# EAGLE design og22 (EAGLE 7.7.0)
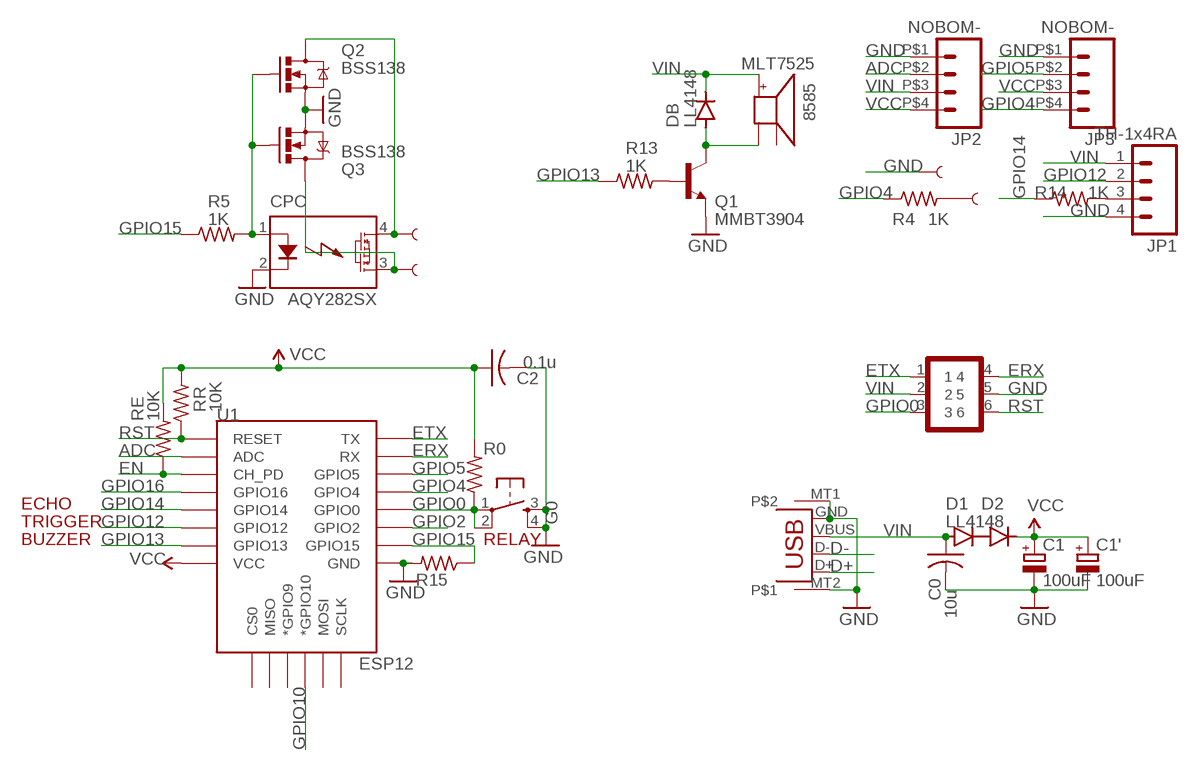
[diagram p0: schematic, sheet 1]

## Parts
8585  MLT7525  BUZZER  [SMT-8585-BUZZER]
C0  10u  C-USC0805K  [C0805K]
C1  100uF  CPOL-EUC  [PANASONIC_C]
C1'  100uF  CPOL-EUC  [PANASONIC_C]
C2  0.1u  C-USC0603K  [C0603K]
CPC  AQY282SX  AQY282  [PHOTOMOS]
D1  LL4148  DIODE-MINIMELF  [MINIMELF]
D2  LL4148  DIODE-MINIMELF  [MINIMELF]
DB  LL4148  DIODE-MINIMELF  [MINIMELF]
G0  TH-6x11  SPST_TACTEVQQ2  [EVQ-Q2]
JP1  TH-1x4RA  M04EXT2  [1X04_SONICSENSOR_EXT2]
JP2  NOBOM-  M042X2  [1X04-2X2]
JP3  NOBOM-  M042X2  [1X04-2X2]
Q1  MMBT3904  TRANSISTOR_NPNSOT23-3  [SOT23-3]
Q2  BSS138  MOSFET-NCHANNELSMD  [SOT23-3]
Q3  BSS138  MOSFET-NCHANNELSMD  [SOT23-3]
R0  10K  R-US_R0603  [R0603]
R4  1K  R-US_R0603  [R0603]
R5  1K  R-US_R0603  [R0603]
R13  1K  R-US_R0603  [R0603]
R14  1K  R-US_R0603  [R0603]
R15  10K  R-US_R0603  [R0603]
RE  10K  R-US_R0603  [R0603]
RR  10K  R-US_R0603  [R0603]
U1  ESP12  ESP12ESMD  [ESP12E-SMD]
U$1  NOBOM-GF2x3  GOLDFINGER_2X3  [GOLDFINGER_2X3]
U$2  NOBOM-  SEWTAP7MMD  [PETAL-7MM-DOUBLE]
U$3  NOBOM-  SEWTAP7MMD  [PETAL-7MM-DOUBLE]
U$4  NOBOM-  SEWTAP7MMD  [PETAL-7MM-DOUBLE]
U$5  NOBOM-  SEWTAP7MMD  [PETAL-7MM-DOUBLE]
X3  MICROXNJ  USB+GND  [USB-MICROB2]

## Nets
ADC: JP2.P$2 U1.ADC
D+: X3.D+
D-: X3.D-
EN [power]: RE.1 U1.CH_PD
ERX: U1.RXD0(RX) U$1.4
ETX: U1.TXD0(TX) U$1.1
GND: C0.2 C1'.- C1.- C2.2 CPC.2(K) G0.3 G0.4 JP1.4 JP2.P$1 JP3.P$1 Q1.2(E) Q2.2(S) Q3.2(S) R15.2 U1.GND U$1.5 U$4.P$1 X3.GND X3.MT1 X3.MT2
GPIO0: G0.1 G0.2 R0.1 U1.GPIO0 U$1.3
GPIO2: U1.GPIO2
GPIO4: JP3.P$4 R4.1 U1.GPIO4
GPIO5: JP3.P$2 U1.GPIO5
GPIO10: U1.GPIO10(*GPIO10)
GPIO12: JP1.2 U1.GPIO12
GPIO13: R13.1 U1.GPIO13
GPIO14: R14.1 U1.GPIO14
GPIO15: R5.1 R15.1 U1.GPIO15
GPIO16: U1.GPIO16
N$1: CPC.4(DS1) Q2.3(D) U$3.P$1
N$2: CPC.3(DS2) Q3.3(D) U$2.P$1
N$3: R4.2 U$5.P$1
N$5: JP1.3 R14.2
N$6 [power]: 8585.- DB.A Q1.3(C)
N$8: Q1.1(B) R13.2
N$9: CPC.1(A) Q2.1(G) Q3.1(G) R5.2
N$11: D1.C D2.A
RST: RR.1 U1.RESET U$1.6
VCC [power]: C1'.+ C1.+ C2.1 D2.C JP2.P$4 JP3.P$3 R0.2 RE.2 RR.2 U1.VCC
VIN [power]: 8585.+ C0.1 D1.A DB.C JP1.1 JP2.P$3 U$1.2 X3.VBUS
Unconnected: 8585.A- U1.CS0 U1.GPIO9(*GPIO9) U1.MISO U1.MOSI U1.SCLK

## Notes on the sheet
- ECHO
- TRIGGER
- BUZZER | RELAY

## Library data of the parts
8585 = adafruit:BUZZER
C0 C2 = adafruit:C-US: CAPACITOR, American symbol
C1 C1' = rcl:CPOL-EU: POLARIZED CAPACITOR, European symbol; SPICEPREFIX: C
CPC = adafruit:AQY282
D1 D2 DB = diode:DIODE-: DIODE
G0 = adafruit_3:SPST_TACT: SMT 6mm switch, EVQQ2 series http://www.ladyada.net/library/eagle
JP1-JP3 = SparkFun:M04: Header 4 Standard 4-pin 0.1" header. Use with straight break away headers (SKU : PRT-00116), right angle break away headers (PRT-00553), swiss pins (PRT-00743), machine pins (PRT-00117), and female headers (PRT-00115). Molex polarized connector foot print use with SKU : PRT-08231 with associated crimp pins and housings.
Q1 = SparkFunNew:TRANSISTOR_NPN: Transistor NPN BJT configuration in SOT23 package. MMBT2222 is the common NPN we use. Double check BCE configuration again layout.
Q2 Q3 = SparkFunNew:MOSFET-NCHANNEL
R0 R15 RE RR = adafruit (picker 的冲突副本 2014-10-29):R-US_: RESISTOR, American symbol
R4 R5 R13 R14 = adafruit2013:R-US_: RESISTOR, American symbol
U1 = esp8266modules:ESP12E: ESP12E Module
U$1 = SparkFunNew:GOLDFINGER_2X3
U$2-U$5 = LilyPad-Wearables:SEWTAP
X3 = SparkFunNew:USB+GND

## Net classes
0 default: width 0.254 mm, clearance 0.203 mm
1 power: width 0.305 mm, clearance 0.203 mm
2 relaypower: width 0.406 mm, clearance 0.305 mm

## Board
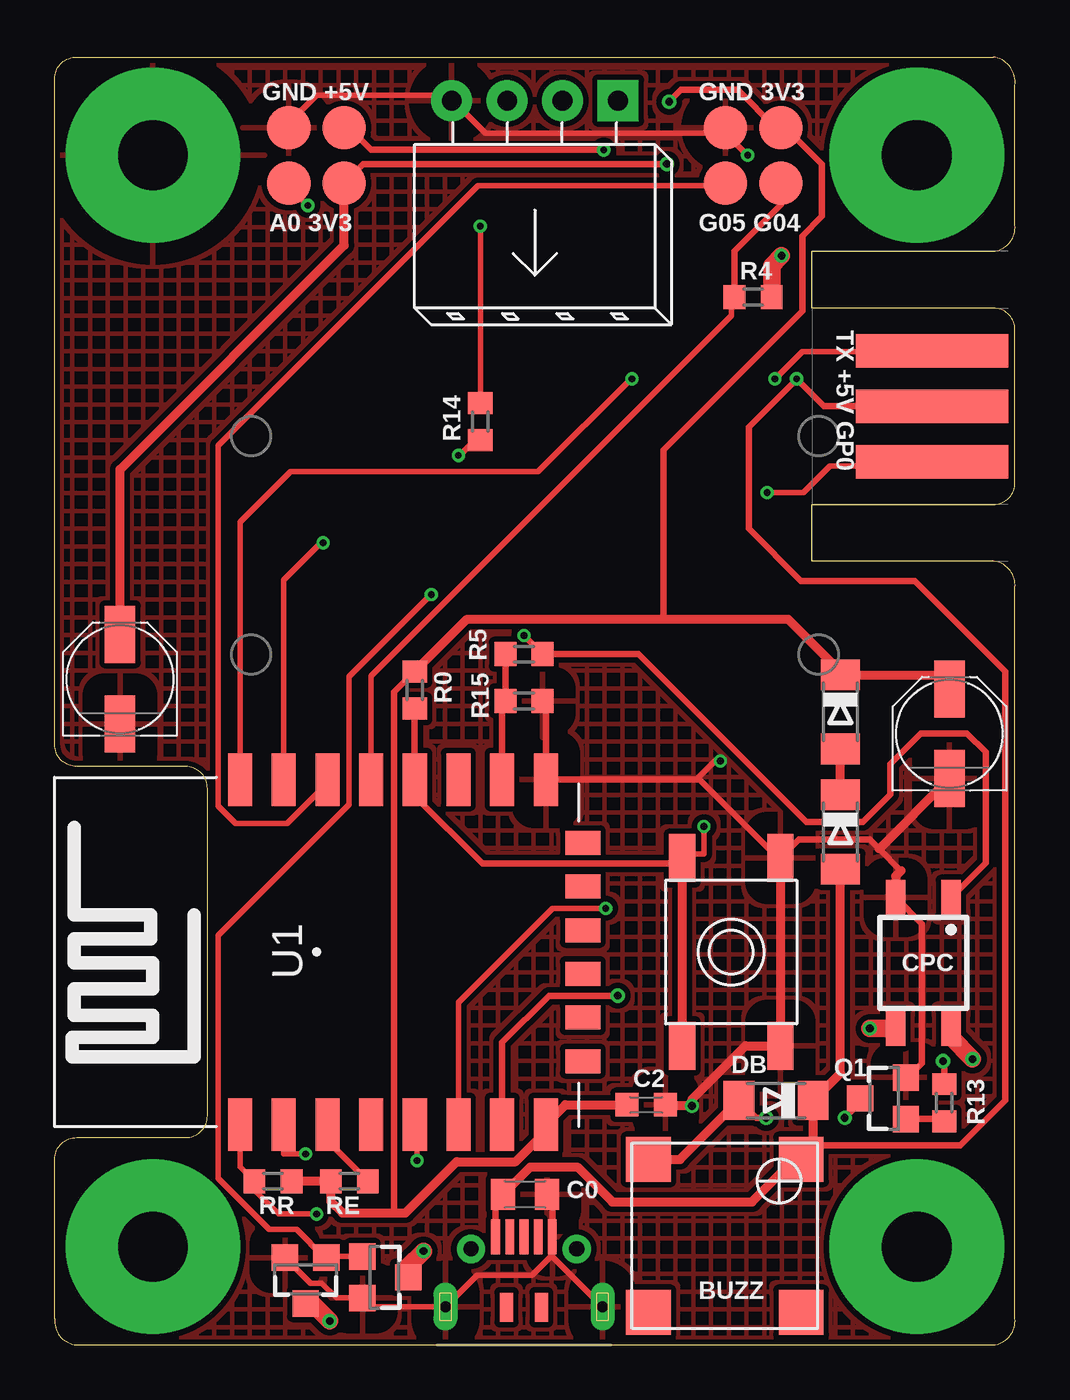
[diagram p1: board, top side]
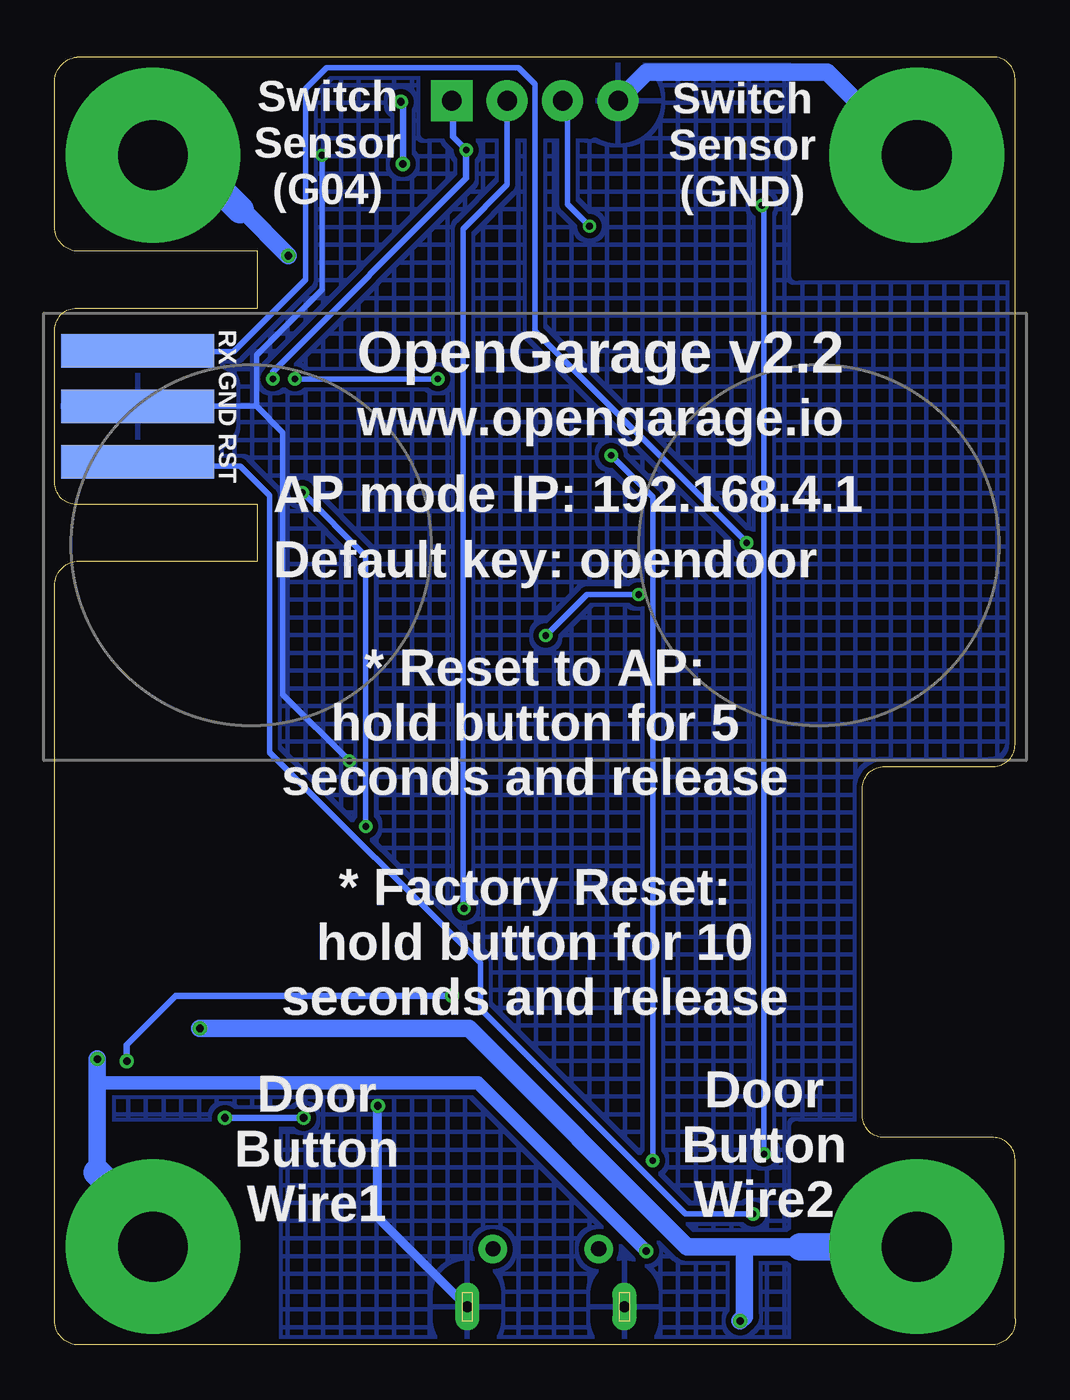
[diagram p2: board, bottom side, seen from below]

Size 44.01 x 59 mm. Coordinates in mm from the lower left corner, seen from the top.
Outline: 1,0 43,0 arc90 44,1.2 44,34.7 arc90 43,35.9 34.7,35.9 34.7,38.5 43,38.5 arc90 44,39.5 44,46.5 arc90 43,47.5 34.7,47.5 34.7,50.1 43,50.1 arc90 44,51.3 44,57.7 arc90 43,59 1,59 arc90 0,58 0,27.5 arc90 1,26.5 6,26.5 arc-90 7,25.5 7,10.5 arc-90 6,9.5 1,9.5 arc90 0,8.5 0,1.2 arc90 1,0
Copper layers (1*16): Top 0.035mm / dielectric 1.5mm / Bottom 0.035mm
Design rules "Fusion_eagle_rule_v1.1 *": minimum track width 6mil, minimum drill 12mil, track to track 6mil, track to pad 6mil, pad to pad 6mil, via to via 6mil, smd to smd 0mil, copper to edge 10mil, drill to drill 10mil, minimum pad ring 10mil, minimum via ring 6mil, stop-mask expansion 2mil, vias tented up to drill 100mil, thermal gap 40mil
bRestrict: area 0,49 to 10,59; area 34,49 to 44,59; area 34,0 to 44,10; area 0,0 to 10,10; area 19.5,55.5 to 27,58.5
vRestrict: area 7,11 to 24,25

### Footprints (pad centres in the part's own frame; a part is rotated, then mirrored left to right if it is on the bottom)
SMT-8585-BUZZER = smd 2.05 x 2.05: + -3.5,3.5; - -3.5,-3.5; A- 3.5,-3.5; NC1 3.5,3.5
C0805K = smd 1.1 x 1.4: 1 -1,0; 2 1,0
PANASONIC_C = smd 2.6 x 1.4: + 2.05,0; - -2.05,0
C0603K = smd 1.05 x 1.08: 1 -0.875,0; 2 0.875,0
PHOTOMOS = smd 0.9 x 1.6: 1 1.27,3; 2 -1.27,3; 3 -1.27,-3; 4 1.27,-3
MINIMELF = smd 1.4 x 1.8: A 1.7,0; C -1.7,0
EVQ-Q2 = smd 2.2 x 1.2: 1 -4.3,-2.25; 2 4.3,-2.25; 3 -4.3,2.25; 4 4.3,2.25
1X04_SONICSENSOR_EXT2 = drill 0.9 pad 1.88 square: 1 -3.81,0 | drill 0.9 pad 1.88: 2 -1.27,0; 3 1.27,0; 4 3.81,0
1X04-2X2 = smd 2 x 2: P$1 -1.27,1.27; P$2 -1.27,-1.27; P$3 1.27,1.27; P$4 1.27,-1.27
SOT23-3 = smd 1.2 x 1.2: 1 1,-0.95; 2 1,0.95; 3 -1.1,0
R0603 = smd 1 x 1.1: 1 -0.85,0; 2 0.85,0
ESP12E-SMD = smd 1.1 x 2.4: ADC -1.5,-7.9; CH_PD 0.5,-7.9; GND 10.5,7.9; GPIO0 4.5,7.9; GPIO2 6.5,7.9; GPIO4 2.5,7.9; GPIO5 0.5,7.9; GPIO12 6.5,-7.9; GPIO13 8.5,-7.9; GPIO14 4.5,-7.9; GPIO15 8.5,7.9; GPIO16 2.5,-7.9; RESET -3.5,-7.9; RXD0 -1.5,7.9; TXD0 -3.5,7.9; VCC 10.5,-7.9 | smd 1.6 x 1.1: CS0 12.2,-5; GPIO9 12.2,-1; GPIO10 12.2,1; MISO 12.2,-3; MOSI 12.2,3; SCLK 12.2,5
GOLDFINGER_2X3 = smd 1.524 x 7: 1 -2.54,-3.5; 2 0,-3.5; 3 2.54,-3.5 | smd 1.524 x 7 bottom: 4 -2.54,-3.5; 5 0,-3.5; 6 2.54,-3.5
PETAL-7MM-DOUBLE = drill 3.2 pad 8: P$1 0,0
USB-MICROB2 = smd 1.6 x 0.4: D+ -1.95,0; D- -1.95,-0.65; GND -1.95,1.3; ID -1.95,0.65; VBUS -1.95,-1.3 | drill 0.5 pad 1.1 long: MT1 1.25,-3.6; MT2 1.25,3.6 | smd 1.35 x 0.6: MT3 1.275,0.8; MT4 1.275,-0.8 | drill 0.7 pad 1.3: MT5 -1.4,-2.425; MT6 -1.4,2.425

### Placement (x,y rotation side)
8585  30.7,5 270 top
C0  21.55,6.9 0 top
C1  41,28 90 top
C1'  3,30.5 90 top
C2  27.1,11 0 top
CPC  39.8,17.5 0 top
D1  36,23.5 270 top
D2  36,29 270 top
DB  33.05,11.2 180 top
G0  31,18 270 top
JP1  22,57 180 top
JP2  12,54.5 0 top
JP3  32,54.5 0 top
Q1  38,11.3 0 top
Q2  15.1,3.1 180 top
Q3  11.5,3 90 top
R0  16.5,30 90 top
R4  32,48 0 top
R5  21.5,31.65 0 top
R13  40.75,11.1 270 top
R14  19.5,42.3 90 top
R15  21.5,29.5 0 top
RE  13.5,7.5 180 top
RR  10,7.5 0 top
U1  12,18 0 top
U$1  43.7,43 270 top
U$2  4.5,4.5 0 bottom
U$3  39.5,4.5 0 bottom
U$4  4.5,54.5 0 bottom
U$5  39.5,54.5 0 bottom
X3  21.5,3 270 top

### Tracks (layer width: path | path; a pad name or v marks a point on that pad's centre or on a via)
ADC  (via drill 0.3)
  Top 0.254: v11.6,52.2 10.75,53.05 JP2.P$2 | v11.5,8.75 10.5,8.75 U1.ADC
  Bottom 0.254: v11.6,52.2 11.5,52.1 v11.5,8.75
EN
  Top 0.305: RE.1 12.5,9.35 U1.CH_PD
ERX  (via drill 0.3)
  Top 0.254: v12.3,36.75 12.2,36.75 10.5,35.05 U1.RXD0
  Bottom 0.254: v12.3,36.75 22,46.45 22,57.75 22.75,58.5 31.55,58.5 32.5,57.55 32.5,48.8 35.8,45.5 40.16,45.5 U$1.4
ETX  (via drill 0.3)
  Top 0.254: U1.TXD0 8.5,37.7 10.8,40 22.15,40 26.4,44.25 v26.45,44.25 | v33,44.25 34.25,45.5 40,45.5 U$1.1
  Bottom 0.254: v33,44.25 v26.45,44.25
GND  (via drill 0.3, 0.35)
  Top 0.254: JP2.P$1 10.75,56 12,57.25 17.75,57.25 18,57 JP1.4 18.25,57 19.75,55.5 30.25,55.5 30.5,55.75 | 30.5,55.75 v31.75,54.5 | 30.5,55.75 JP3.P$1 | v30.5,26.75 30.25,26.75 29.5,26 29.55,25.9 | Q3.2 11.72,2.83 12.24,2.83 12.92,2.15 Q2.2 14.5,1.75 X3.MT1 19.35,3.2 21.87,3.2 22.69,4.02 | 22.69,4.02 22.8,4.13 X3.GND | X3.MT2 22.84,4.02 22.69,4.02
  Top 0.305: R15.2 22.5,29.35 U1.GND 29.55,25.9 33.25,22.2 | G0.3 34.1,23.15 37.35,23.15 37.78,22.73 38.78,21.73 | Q1.2 39.09,12.25 39.74,12.9 39.74,19.29 CPC.2 | X3.GND 22.8,6.65
  Top 0.406: 22.8,6.65 C0.2 | C1.- 37.78,22.73 | 38.78,21.73 38.53,21.48 CPC.2 | G0.3 33.25,22.2 G0.4 31.65,13.7 29.2,11.25 v29.2,10.95 28.03,10.95 C2.2
  Bottom 0.254: 34.75,43 U$1.5 | 34.75,43 34.75,45.35 31.75,48.35 v31.75,54.5 | v30.5,26.75 33.55,29.8 33.55,41.8 34.75,43
  Bottom 0.406: v29.2,10.95 29.2,5.85 X3.MT2
  Bottom 0.813: JP1.4 16.89,58.3 8.6,58.3 4.8,54.5 U$4.P$1
  pour Top (isolate 0.254, hatched): 0,59 44,59 44,0 0,0
  pour Bottom (isolate 0.254, hatched): 0,59 44,59 44,0 0,0
GPIO0  (via drill 0.3)
  Top 0.254: U$1.3 40,40.26 35.51,40.26 34.3,39.05 v32.65,39.05 | v29.75,23.75 29.75,22.5 28.75,22.5 G0.1
  Top 0.305: R0.1 U1.GPIO0 16.5,25.15 19.6,22.05 28.75,22.05
  Top 0.406: G0.1 28.75,22.05 G0.2
  Bottom 0.254: v32.65,39.05 29.75,36.15 v29.75,23.75
GPIO4
  Top 0.254: U1.GPIO4 14.5,30.65 31,47.15 31,48 R4.1
  Top 0.305: JP3.P$4 33.27,52.23 31.15,50.11 R4.1
GPIO5
  Top 0.254: JP3.P$2 30.6,53.1 19.4,53.1 7.5,41.2 7.5,24.7 8.3,23.9 10.65,23.9 12.5,25.75 U1.GPIO5
GPIO12  (via drill 0.3)
  Top 0.254: v25.25,20 22.8,20 18.5,15.7 U1.GPIO12
  Bottom 0.254: JP1.2 23.27,53.15 25.3,51.12 25.3,20.05 v25.25,20
GPIO13  (via drill 0.35)
  Top 0.305: v25.8,16 v25.8,15.99 22.65,15.99 20.5,13.85 U1.GPIO13 | v40.7,13 40.75,12.95 R13.1
  Bottom 0.305: v25.8,16 38.45,16 40.7,13.75 v40.7,13
GPIO14  (via drill 0.3)
  Top 0.254: R14.1 19.25,41.45 18.55,40.75 v18.5,40.75 | U1.GPIO14 16.6,10 v16.6,8.45
  Bottom 0.254: v18.5,40.75 16.6,38.85 v16.6,8.45
GPIO15
  Top 0.305: U1.GPIO15 20.5,29.35 R15.1 R5.1
N$1  (via drill 0.35)
  Top 0.813: v42.05,13.1 41.07,14.08 CPC.4 | Q2.3 16.2,3.6 v16.9,4.3
  Bottom 0.61: v16.9,4.3 24.6,12 42.05,12
  Bottom 0.813: v42.05,13.1 42.05,12 42.05,7.9
  Bottom 1.27: U$3.P$1 39.5,5.35 42.05,7.9
N$2  (via drill 0.35)
  Top 0.813: v37.35,14.5 CPC.3 | Q3.3 11.8,1.9 v12.6,1.1
  Bottom 0.813: 9.85,4.5 12.4,4.5 | 12.4,4.5 15.03,4.5 25.03,14.5 v37.35,14.5 | v12.6,1.1 12.4,1.3 12.4,4.5
  Bottom 1.27: U$2.P$1 9.85,4.5
N$3  (via drill 0.35)
  Top 0.813: v33.3,49.9 32.85,49.45 R4.2
  Bottom 0.813: 35.5,52 35.4,52 v33.3,49.9
  Bottom 1.27: U$5.P$1 38,54.5 35.5,52
N$5  (via drill 0.3)
  Top 0.254: v19.5,51.25 R14.2
  Bottom 0.254: v19.5,51.25 20.5,52.25 20.5,57 JP1.3
N$6  (via drill 0.35)
  Top 0.305: Q1.3 36.9,11.1 v36.2,10.4 | v32.6,10.4 32.15,10.4 DB.A
  Top 0.406: 8585.- 28.65,8.5 DB.A
  Bottom 0.305: v36.2,10.4 v32.6,10.4
N$8
  Top 0.305: Q1.1 40.65,10.35 R13.2
N$9  (via drill 0.3)
  Top 0.254: Q2.1 12.5,4.05 Q3.1 12.38,4 11.08,5.3 9.83,5.3 7.5,7.62 7.5,18.75 13.5,24.75 13.5,30.62 v17.25,34.38 | R5.2 v21.5,32.5
  Top 0.305: R5.2 26.75,31.65 34.45,23.95 37.03,23.95 38.29,25.21 38.29,26.62 39.68,28.01 41.8,28.01 42.65,27.16 42.65,22.08 CPC.1
  Bottom 0.254: v17.25,34.38 19.63,34.38 v21.5,32.5
N$11
  Top 0.406: D1.C D2.A
RST  (via drill 0.3)
  Top 0.254: U1.RESET 8.5,8.15 RR.1 9.15,7.1 10.25,6 v12,6
  Bottom 0.254: v12,6 15.1,6 24.5,15.4 24.5,17.5 34.15,27.15 34.15,38.9 35.5,40.25 40,40.25 U$1.6
VCC  (via drill 0.35)
  Top 0.305: R0.2 15.55,29.9 15.55,6.04 | 27.9,33.25 27.9,41 34.25,47.35 34.25,50.8 35.15,51.7 35.15,54.1 33.5,55.75 JP3.P$3 33.03,55.77 31.3,57.5 28.7,57.5 v28.15,56.95 | v28.05,54.1 25.44,54.1 25.43,54.09 14.13,54.09 JP2.P$4
  Top 0.406: RR.2 RE.2 12.65,6.58 13.19,6.04 15.55,6.04 16.07,6.04 18.42,8.39 21.12,8.39 22.5,9.78 U1.VCC 23.4,11 C2.1 | D2.C 36.15,30.7 | 36.15,30.7 40.35,30.7 C1.+ | R0.2 18.9,33.25 27.9,33.25 33.6,33.25 36.15,30.7 | C1'.+ 3,40.11 13.27,50.38 JP2.P$4
  Bottom 0.305: v28.15,56.95 28.05,56.85 v28.05,54.1
VIN  (via drill 0.3)
  Top 0.305: v25.15,54.75 14.5,54.75 13.5,55.75 JP2.P$3 | U$1.2 35.25,43 v34,44.25 31.8,42.05 31.8,37.4 34.2,35 39.4,35 43.55,30.85 43.55,11.2 41.5,9.15 34.68,9.15 8585.+ | X3.VBUS 20.2,6.55
  Top 0.406: 20.2,6.55 C0.1 21.8,8.15 23.95,8.15 25.55,6.55 31.95,6.55 34.2,8.8 | 8585.+ 34.2,8.8 | D1.A 36,12.45 DB.C 34.75,9.35 34.2,8.8
  Bottom 0.305: JP1.1 25.75,57 25.75,55.35 v25.15,54.75 25.15,53.45 34,44.6 v34,44.25

### Text on the board
tNames: GND +5V | GND 3V3 | A0 3V3 | G05 G04 | TX +5V GP0 | BUZZ
bNames: Switch / Sensor / (GND) | Switch / Sensor / (G04) | OpenGarage v2.2 | RX GND RST | www.opengarage.io | AP mode IP: 192.168.4.1 | Default key: opendoor | * Reset to AP: / hold button for 5 / seconds and release / / * Factory Reset: / hold button for 10 / seconds and release | Door / Button / Wire2 | Door / Button / Wire1